# EAGLE design BetaRev1 (EAGLE 6.5.0)
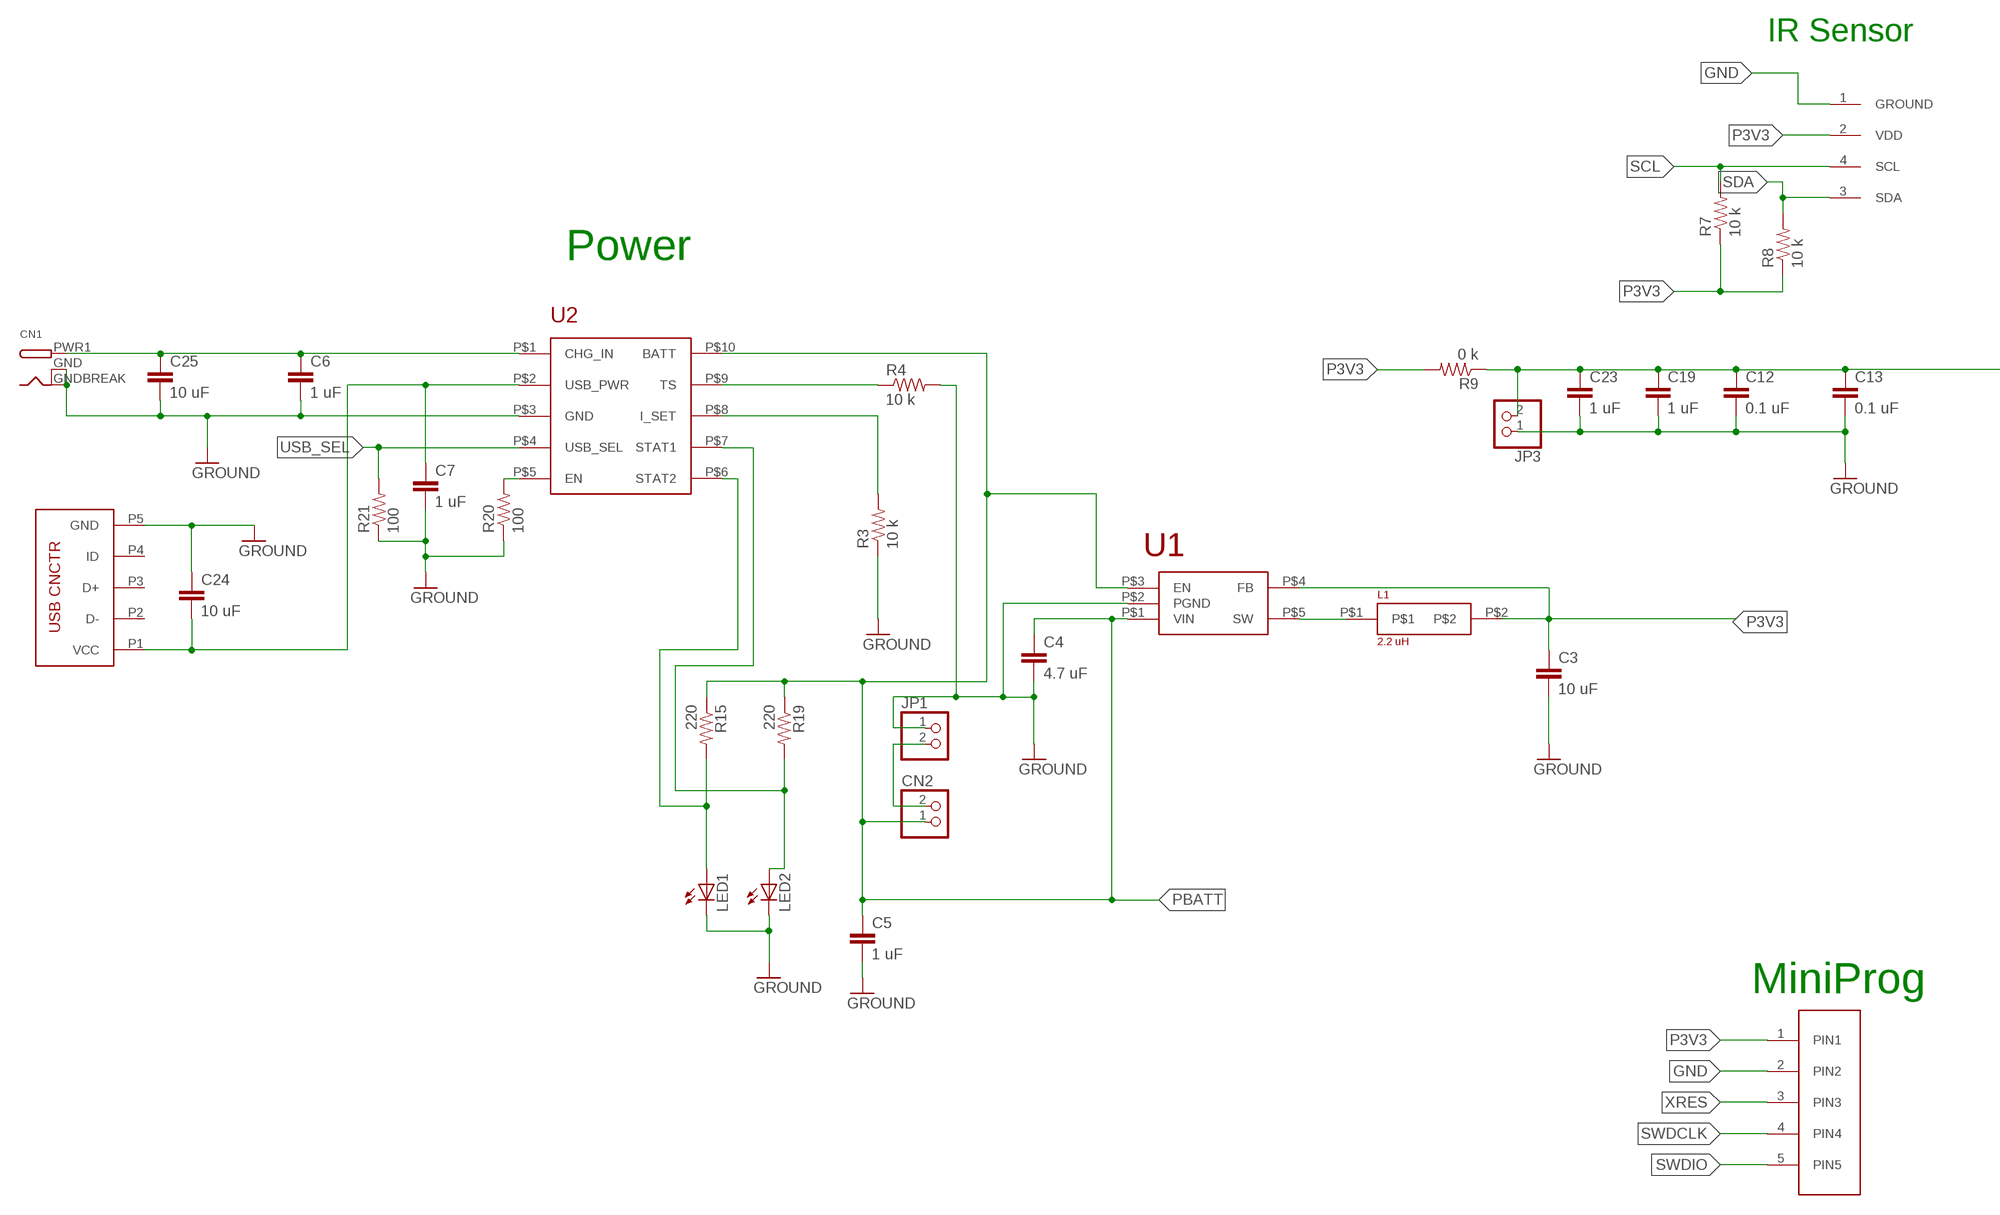
[diagram p0: schematic, sheet 1, part 1 of 2]
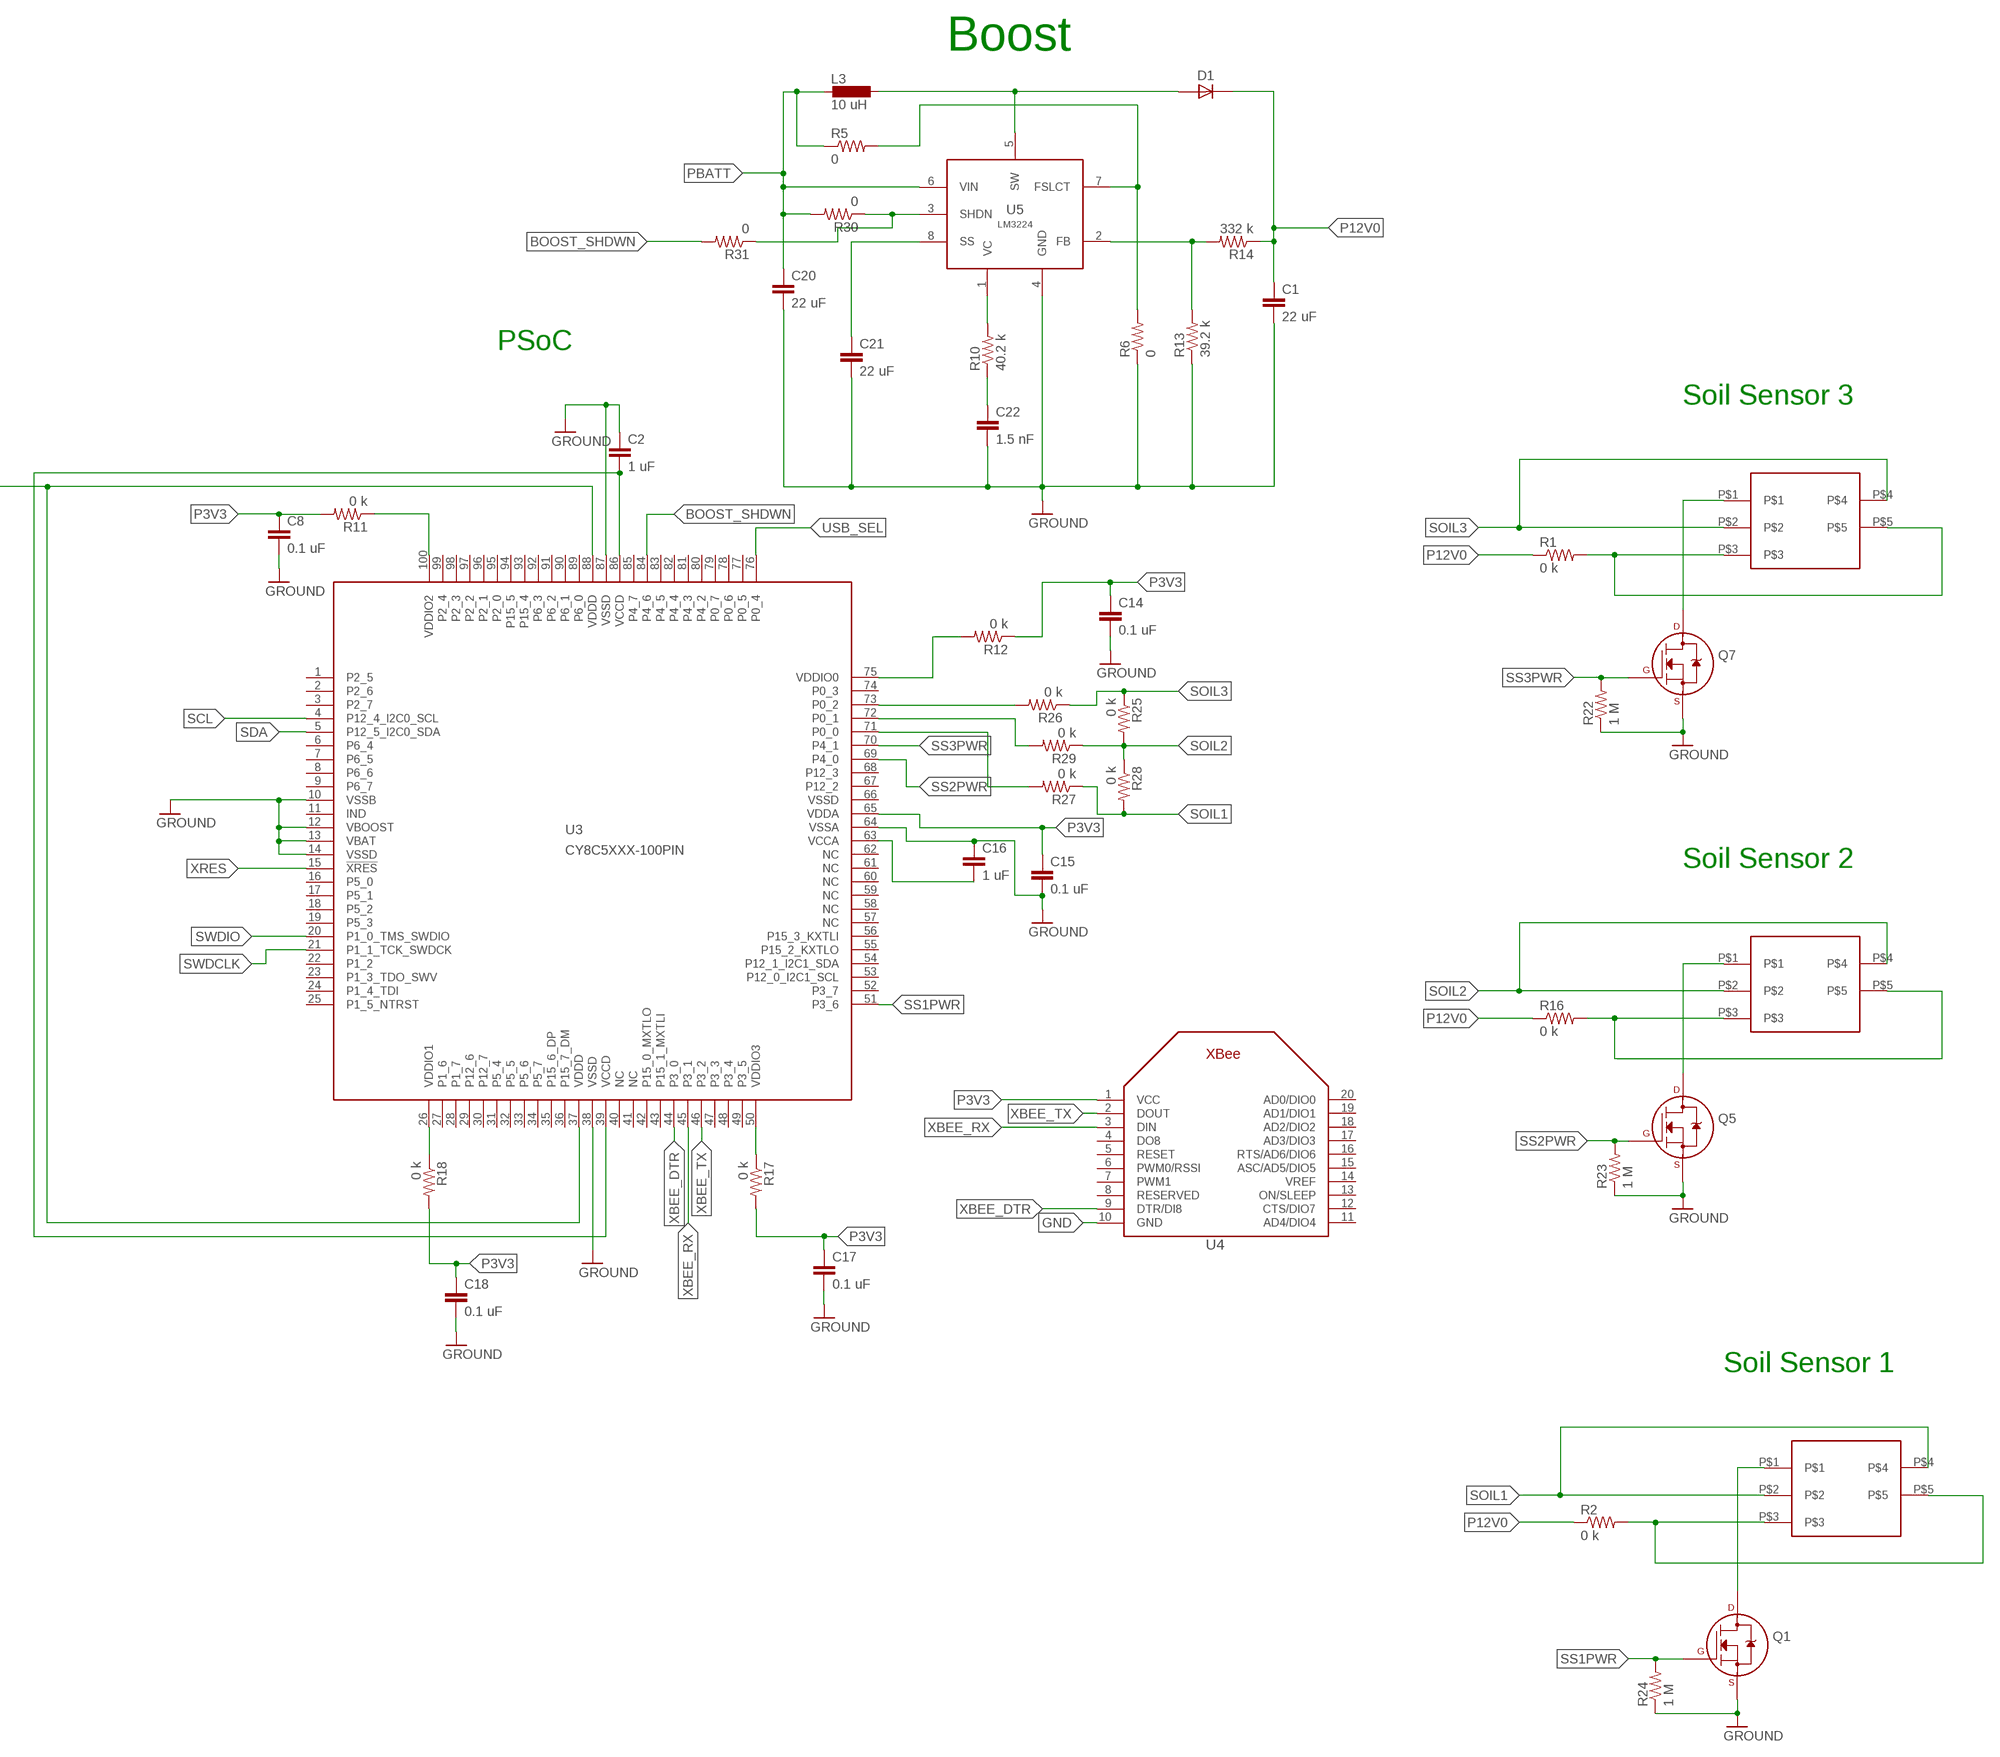
[diagram p1: schematic, sheet 1, part 2 of 2]

## Parts
C1  22 uF  CAPACITOR0805  [0805]
C2  1 uF  CAPACITOR0603  [0603]
C3  10 uF  CAPACITOR0603  [0603]
C4  4.7 uF  CAPACITOR0603  [0603]
C5  1 uF  CAPACITOR0603  [0603]
C6  1 uF  CAPACITOR0603  [0603]
C7  1 uF  CAPACITOR0603  [0603]
C8  0.1 uF  CAPACITOR0603  [0603]
C12  0.1 uF  CAPACITOR0603  [0603]
C13  0.1 uF  CAPACITOR0603  [0603]
C14  0.1 uF  CAPACITOR0603  [0603]
C15  0.1 uF  CAPACITOR0603  [0603]
C16  1 uF  CAPACITOR0603  [0603]
C17  0.1 uF  CAPACITOR0603  [0603]
C18  0.1 uF  CAPACITOR0603  [0603]
C19  1 uF  CAPACITOR0603  [0603]
C20  22 uF  CAPACITOR0603  [0603]
C21  22 uF  CAPACITOR0603  [0603]
C22  1.5 nF  CAPACITOR0603  [0603]
C23  1 uF  CAPACITOR0603  [0603]
C24  10 uF  CAPACITOR0603  [0603]
C25  10 uF  CAPACITOR0603  [0603]
CN1  DCBARRELSMT  [DCJACK_2MM_SMT]
CN2  JST_2PIN-SMT-RA  [JST-PH-2-SMT-RA]
D1  DIODE  [0603-LED]
IRSENSOR  TO39  [TO39]
JP1  PINHD-1X2  [1X02]
JP3  PINHD-1X2  [1X02]
L1  LPO3310  [LPO3310]
L3  10 uH  DO3316P  [DO3316P]
LED1  LEDCHIP-LED0603  [CHIP-LED0603]
LED2  LEDCHIP-LED0603  [CHIP-LED0603]
MINIPROG  HEADER-5  [NON-5]
Q1  2N7000_SOT23  [SOT-23]
Q5  2N7000_SOT23  [SOT-23]
Q7  2N7000_SOT23  [SOT-23]
R1  0 k  RESISTOR0603  [0603]
R2  0 k  RESISTOR0603  [0603]
R3  10 k  RESISTOR0603  [0603]
R4  10 k  RESISTOR0603  [0603]
R5  0  RESISTOR0603  [0603]
R6  0  RESISTOR0603  [0603]
R7  10 k  RESISTOR0603  [0603]
R8  10 k  RESISTOR0603  [0603]
R9  0 k  RESISTOR0603  [0603]
R10  40.2 k  RESISTOR0603  [0603]
R11  0 k  RESISTOR0603  [0603]
R12  0 k  RESISTOR0603  [0603]
R13  39.2 k  RESISTOR0603  [0603]
R14  332 k  RESISTOR0603  [0603]
R15  220  RESISTOR0603  [0603]
R16  0 k  RESISTOR0603  [0603]
R17  0 k  RESISTOR0603  [0603]
R18  0 k  RESISTOR0603  [0603]
R19  220  RESISTOR0603  [0603]
R20  100  RESISTOR0603  [0603]
R21  100  RESISTOR0603  [0603]
R22  1 M  RESISTOR0603  [0603]
R23  1 M  RESISTOR0603  [0603]
R24  1 M  RESISTOR0603  [0603]
R25  0 k  RESISTOR0603  [0603]
R26  0 k  RESISTOR0603  [0603]
R27  0 k  RESISTOR0603  [0603]
R28  0 k  RESISTOR0603  [0603]
R29  0 k  RESISTOR0603  [0603]
R30  0  RESISTOR0603  [0603]
R31  0  RESISTOR0603  [0603]
U1  LM3671-407564  [LM3671-407564]
U2  LM3658  [LM3658]
U3  CY8C5XXX-100PIN  [TQFP-14X14-100]
U4  XBEE  [XBEE]
U5  LM3224  [MSOP-8]
U$1  FCI10118192-0001LF  [FCI10118192-0001LF]
U$2  AUDIOJACK  [AUDIOJACK]
U$3  AUDIOJACK  [AUDIOJACK]
U$4  AUDIOJACK  [AUDIOJACK]

## Nets
BOOST_SHDWN: R31.2 U3.84(P4_6)
GND: C1.2 C2.1 C3.2 C4.2 C5.2 C6.2 C7.2 C8.2 C12.2 C13.2 C14.2 C15.2 C16.1 C17.2 C18.2 C19.2 C20.2 C21.2 C22.2 C23.2 C24.1 C25.2 CN1.GND(GNDBREAK) CN1.GNDBREAK(GND) IRSENSOR.1(GROUND) JP1.1 JP3.1 LED1.C LED2.C MINIPROG.2(PIN2) Q1.2(S) Q5.2(S) Q7.2(S) R3.1 R4.2 R6.1 R13.1 R20.1 R21.1 R22.1 R23.1 R24.1 U1.P$2(PGND) U2.P$3(GND) U3.10(VSSB) U3.12(VBOOST) U3.13(VBAT) U3.14(VSSD) U3.38(VSSD) U3.64(VSSA) U3.87(VSSD) U4.10(GND) U5.4(GND) U$1.P5(GND) ; supply symbol labelled GROUND
N$1: R20.2 U2.P$5(EN)
N$2: R3.2 U2.P$8(I_SET)
N$3: C21.1 U5.8(SS)
N$4: R1.2 U$3.P$3 U$3.P$5
N$5: C6.1 C25.1 CN1.PWR1(PWR) U2.P$1(CHG_IN)
N$6: R2.2 U$4.P$3 U$4.P$5
N$7: D1.A L3.2 U5.5(SW)
N$8: R4.1 U2.P$9(TS)
N$9: R10.2 U5.1(VC)
N$10: CN2.2 JP1.2
N$11: C22.1 R10.1
N$12: R13.2 R14.2 U5.2(FB)
N$13: C2.2 U3.39(VCCD) U3.86(VCCD)
N$14: Q1.3(D) U$4.P$1
N$15: C16.2 U3.63(VCCA)
N$16: R5.2 R6.2 U5.7(FSLCT)
N$17: R16.2 U$2.P$3 U$2.P$5
N$18: R12.2 U3.75(VDDIO0)
N$19: R11.1 U3.100(VDDIO2)
N$20: R18.1 U3.26(VDDIO1)
N$21: C12.1 C13.1 C19.1 C23.1 JP3.2 R9.1 U3.37(VDDD) U3.88(VDDD)
N$22: R17.1 U3.50(VDDIO3)
N$23: Q5.3(D) U$2.P$1
N$24: Q7.3(D) U$3.P$1
N$25: LED2.A R19.2 U2.P$7(STAT1)
N$26: LED1.A R15.2 U2.P$6(STAT2)
N$27: R26.2 U3.73(P0_2)
N$28: L1.P$1 U1.P$5(SW)
N$29: R29.2 U3.72(P0_1)
N$30: R27.2 U3.71(P0_0)
N$47: R30.1 R31.1 U5.3(SHDN)
P3V3: C3.1 C8.1 C14.1 C15.1 C17.1 C18.1 IRSENSOR.2(VDD) L1.P$2 MINIPROG.1(PIN1) R7.1 R8.1 R9.2 R11.2 R12.1 R17.2 R18.2 U1.P$4(FB) U3.65(VDDA) U4.1(VCC)
P12V0: C1.1 D1.C R1.1 R2.1 R14.1 R16.1
PBATT: C4.1 C5.1 C20.1 CN2.1 L3.1 R5.1 R15.1 R19.1 R30.2 U1.P$1(VIN) U1.P$3(EN) U2.P$10(BATT) U5.6(VIN)
SCL: IRSENSOR.4(SCL) R7.2 U3.4(P12_4_I2C0_SCL)
SDA: IRSENSOR.3(SDA) R8.2 U3.5(P12_5_I2C0_SDA)
SOIL1: R27.1 R28.2 U$4.P$2 U$4.P$4
SOIL2: R25.2 R28.1 R29.1 U$2.P$2 U$2.P$4
SOIL3: R25.1 R26.1 U$3.P$2 U$3.P$4
SS1PWR: Q1.1(G) R24.2 U3.51(P3_6)
SS2PWR: Q5.1(G) R23.2 U3.69(P4_0)
SS3PWR: Q7.1(G) R22.2 U3.70(P4_1)
SWDCLK: MINIPROG.4(PIN4) U3.21(P1_1_TCK_SWDCK)
SWDIO: MINIPROG.5(PIN5) U3.20(P1_0_TMS_SWDIO)
USB: C7.1 C24.2 U2.P$2(USB_PWR) U$1.P1(VCC)
USB_SEL: R21.2 U2.P$4(USB_SEL) U3.76(P0_4)
XBEE_DTR: U3.44(P3_0) U4.9(DTR/DI8)
XBEE_RX: U3.45(P3_1) U4.3(DIN)
XBEE_TX: U3.46(P3_2) U4.2(DOUT)
XRES: MINIPROG.3(PIN3) U3.15(!XRES!)
Unconnected: U3.1(P2_5) U3.2(P2_6) U3.3(P2_7) U3.6(P6_4) U3.7(P6_5) U3.8(P6_6) U3.9(P6_7) U3.11(IND) U3.16(P5_0) U3.17(P5_1) U3.18(P5_2) U3.19(P5_3) U3.22(P1_2) U3.23(P1_3_TDO_SWV) U3.24(P1_4_TDI) U3.25(P1_5_NTRST) U3.27(P1_6) U3.28(P1_7) U3.29(P12_6) U3.30(P12_7) U3.31(P5_4) U3.32(P5_5) U3.33(P5_6) U3.34(P5_7) U3.35(P15_6_DP) U3.36(P15_7_DM) U3.40(NC) U3.41(NC) U3.42(P15_0_MXTLO) U3.43(P15_1_MXTLI) U3.47(P3_3) U3.48(P3_4) U3.49(P3_5) U3.52(P3_7) U3.53(P12_0_I2C1_SCL) U3.54(P12_1_I2C1_SDA) U3.55(P15_2_KXTLO) U3.56(P15_3_KXTLI) U3.57(NC) U3.58(NC) U3.59(NC) U3.60(NC) U3.61(NC) U3.62(NC) U3.66(VSSD) U3.67(P12_2) U3.68(P12_3) U3.74(P0_3) U3.77(P0_5) U3.78(P0_6) U3.79(P0_7) U3.80(P4_2) U3.81(P4_3) U3.82(P4_4) U3.83(P4_5) U3.85(P4_7) U3.89(P6_0) U3.90(P6_1) U3.91(P6_2) U3.92(P6_3) U3.93(P15_4) U3.94(P15_5) U3.95(P2_0) U3.96(P2_1) U3.97(P2_2) U3.98(P2_3) U3.99(P2_4) U4.4(DO8) U4.5(RESET) U4.6(PWM0/RSSI) U4.7(PWM1) U4.8(RESERVED) U4.11(AD4/DIO4) U4.12(CTS/DIO7) U4.13(ON/SLEEP) U4.14(VREF) U4.15(ASC/AD5/DIO5) U4.16(RTS/AD6/DIO6) U4.17(AD3/DIO3) U4.18(AD2/DIO2) U4.19(AD1/DIO1) U4.20(AD0/DIO0) U$1.P2(D-) U$1.P3(D+) U$1.P4(ID)

## Notes on the sheet
- Boost
- IR Sensor
- PSoC
- Power
- Soil Sensor 3
- Soil Sensor 2
- MiniProg
- Soil Sensor 1

## Library data of the parts
C1-C8 C12-C25 = LAB1_BREAKOUT:CAPACITOR: Generic Capacitor
CN1 = adafruit:DCBARREL: 2.0mm DC Barrel Jack DCJACK_2MM_PTH - Through Hole Jack (4UConnector: 05537)
CN2 = adafruit:JST_2PIN: JST 2-Pin Connectors of various flavors SMT-RA (S2B-PH-SM4) 4UConnector #17311 SMT (B2B-PH-SM4) THM-RA (S2B-PH) THM (B2B-PH)
D1 = Alpha (3):DIODE
IRSENSOR = mlx:TO39
JP1 JP3 = pinhead:PINHD-1X2: PIN HEADER
L1 = 136PWR:LPO3310: Coilcraft LPO3310 2.2 uH power inductor 150 mOhms
L3 = inductor-coilcraft:DO3316P: COILCRAFT; OC_FARNELL: unknown; OC_NEWARK: unknown
LED1 LED2 = adafruit:LED: LED OSRAM: - CHIPLED LG R971, LG N971, LY N971, LG Q971, LY Q971, LO R971, LY R971 LH N974, LH R974 LS Q976, LO Q976, LY Q976 LO Q996 - Hyper CHIPLED LW Q18S LB Q993, LB Q99A, LB R99A - SideLED LS A670, LO A670, LY A670, LG A670, LP A670 LB A673, LV A673, LT A673, LW A673 LH A674 LY A675 LS A676, LA A676, LO A676, LY A676, LW A676 LS A679, LY A679, LG A679 - Hyper Micro SIDELED® LS Y876, LA Y876, LO Y876, LY Y876 LT Y87S - SmartLED LW L88C, LW L88S LB L89C, LB L89S, LG L890 LS L89K, LO L89K, LY L89K LS L896, LA L896, LO L896, LY L896 - TOPLED LS T670, LO T670, LY T670, LG T670, LP T670 LSG T670, LSP T670, LSY T670, LOP T670, LYG T670 LG T671, LOG T671, LSG T671 LB T673, LV T673, LT T673, LW T673 LH T674 LS T676, LA T676, LO T676, LY T676, LB T676, LH T676, LSB T676, LW T676 LB T67C, LV T67C, LT T67C, LS T67K, LO T67K, LY T67K, LW E67C LS E67B, LA E67B, LO E67B, LY E67B, LB E67C, LV E67C, LT E67C LW T67C LS T679, LY T679, LG T679 LS T770, LO T770, LY T770, LG T770, LP T770 LB T773, LV T773, LT T773, LW T773 LH T774 LS E675, LA E675, LY E675, LS T675 LS T776, LA T776, LO T776, LY T776, LB T776 LHGB T686 LT T68C, LB T68C - Hyper Mini TOPLED® LB M676 - Mini TOPLED Santana® LG M470 LS M47K, LO M47K, LY M47K Source: http://www.osram.convergy.de/
MINIPROG = LAB1_BREAKOUT:HEADER-5: General 5 Pin 1 Row 2.54mm Spacing Connector
Q1 Q5 Q7 = transistors:2N700*: 2N7000, 2N7002, NDS7002A N-channel enhancement mode MOSFET
R1-R31 = LAB1_BREAKOUT:RESISTOR: Generic Resistor
U1 = 136PWR:LM3671-407564: DC DC voltage regulator
U2 = LM3658:LM3658
U3 = cypress_psoc_V2_0:CY8C5XXX-100PIN: Cypress PSoC® 5 - Programmable System on Chip, ARM Cortex-M3 Based Source Data: http://www.cypress.com/?mpn=CY8C5588AXI-060 LBR Source: http://www.westmarkelectronics.com Thomas W. Moxon Director of Engineering www.westmarkelectronics.com; MPN: CY8C5588AXI-060
U4 = Alpha (3):XBEE
U5 = Alpha (3):LM3224
U$1 = USB_Connectors_5P_Micro_USB:FCI10118192-0001LF
U$2-U$4 = AudioJack:AUDIOJACK

## Board
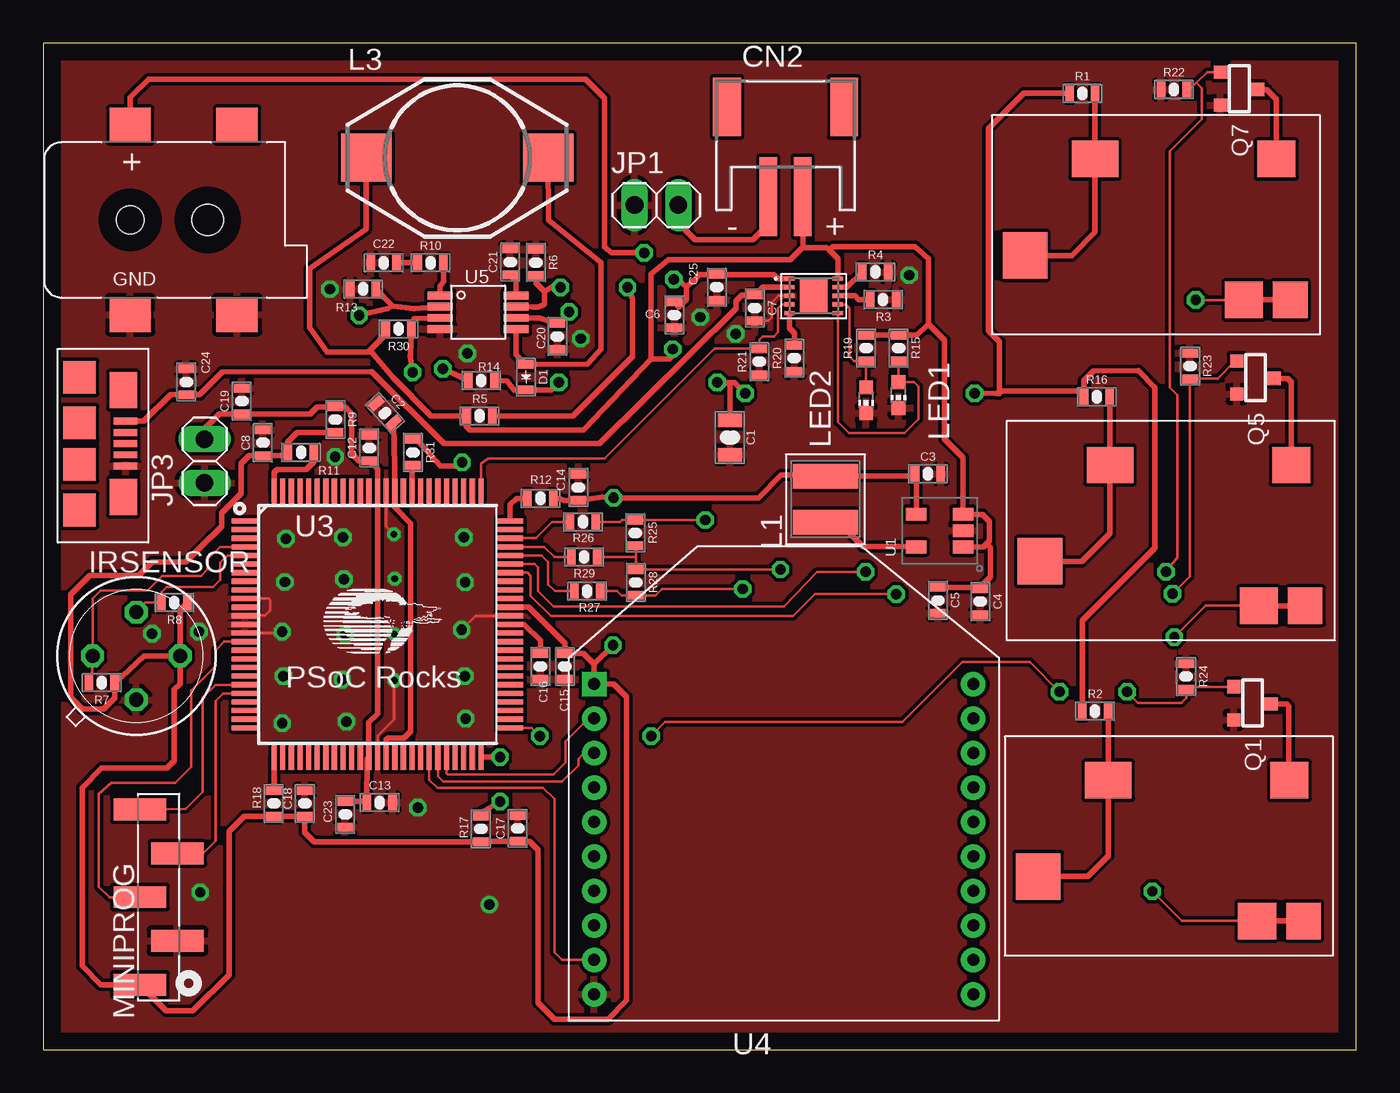
[diagram p2: board, top side]
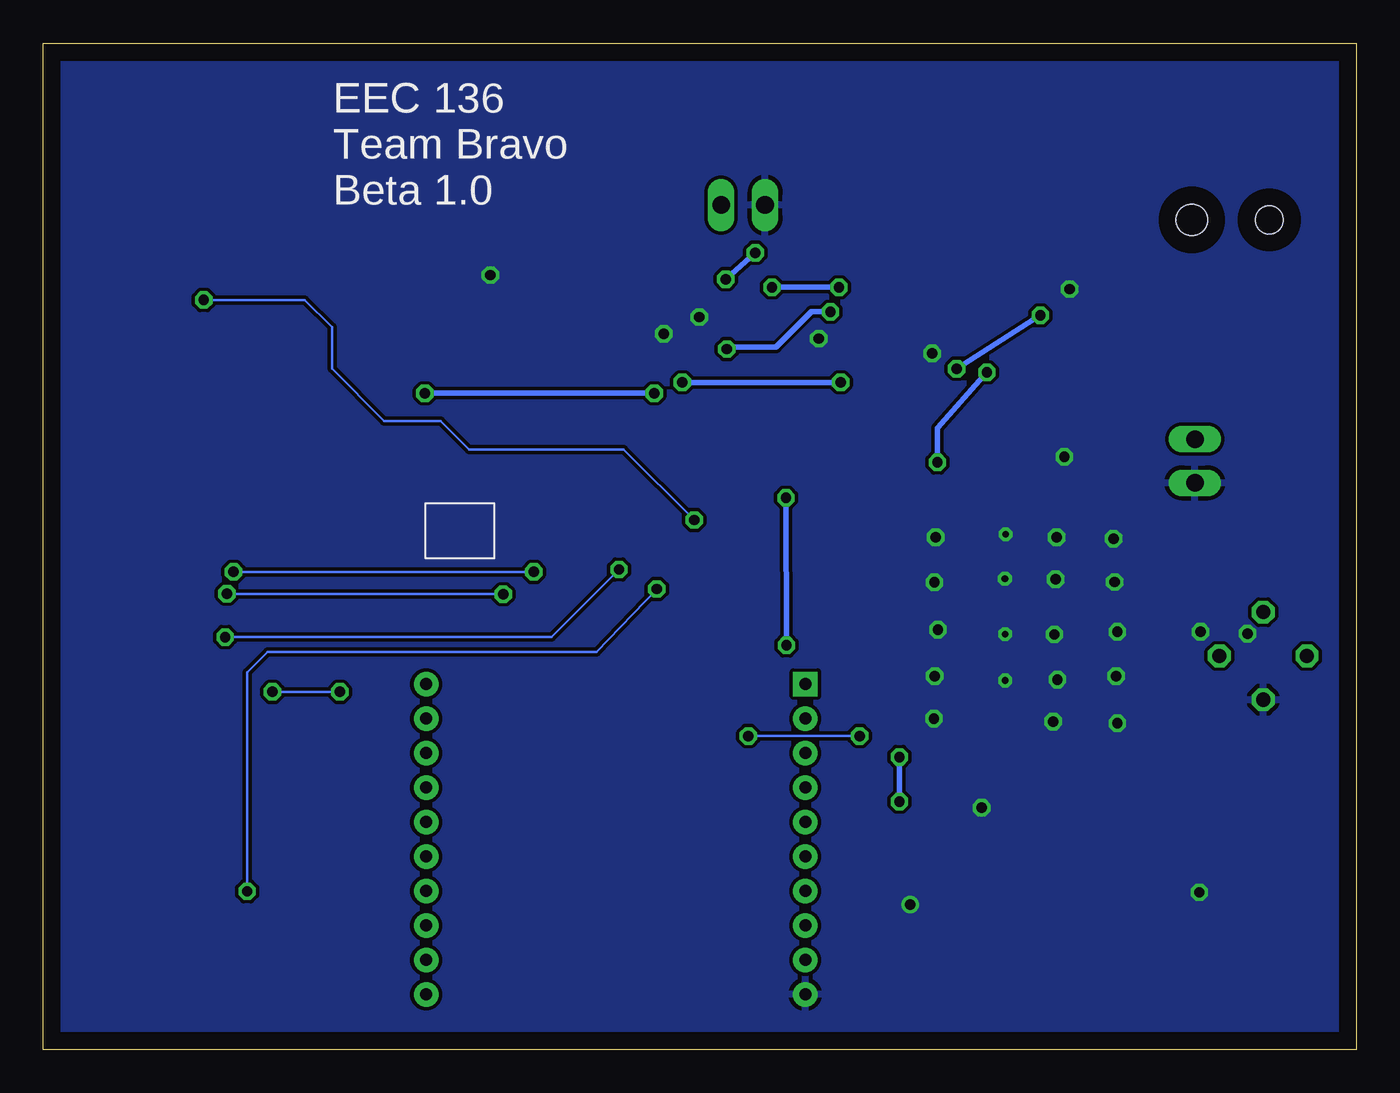
[diagram p3: board, bottom side, seen from below]

Size 76.2 x 58.42 mm. Coordinates in mm from the lower left corner, seen from the top.
Outline: 0,0 76.2,0 76.2,58.42 0,58.42 0,0
Copper layers (1*16): Top 0.035mm / dielectric 1.5mm / Bottom 0.035mm
Design rules "default": minimum track width 10mil, minimum drill 24mil, track to track 8mil, track to pad 8mil, pad to pad 8mil, via to via 8mil, smd to smd 8mil, copper to edge 40mil, drill to drill 8mil, minimum pad ring 10mil, minimum via ring 8mil, stop-mask expansion 4mil, vias tented up to drill 0mil, thermal gap 10mil

### Footprints (pad centres in the part's own frame; a part is rotated, then mirrored left to right if it is on the bottom)
0805 = smd 0.8 x 1.4: 1 -1,0; 2 1,0
0603 = smd 0.5 x 0.9: 1 -0.75,0; 2 0.75,0
DCJACK_2MM_SMT = smd 2.4 x 2: GND 0,-5.5; GNDBREAK 6.2,-5.5; PWR1 0,5.5; PWR2 6.2,5.5 | hole 1.6: 0,0 | hole 1.8: 4.5,0
JST-PH-2-SMT-RA = smd 1 x 4.6: 1 1,-3.7; 2 -1,-3.7 | smd 1.6 x 3.4: NC1 -3.4,1.5; NC2 3.4,1.5
0603-LED = smd 0.5 x 0.9: A -0.75,0; C 0.75,0
TO39 = drill 0.813 octagon: 1 0,-2.54; 2 2.54,0; 3 0,2.54; 4 -2.54,0
1X02 = drill 1.016 long: 1 -1.27,0; 2 1.27,0
LPO3310 = smd 1.42 x 3.76: P$1 -1.34,0; P$2 1.34,0
DO3316P = smd 2.92 x 2.79: 1 -5.28,0; 2 5.28,0
CHIP-LED0603 = smd 0.8 x 0.8: A 0,-0.75; C 0,0.75
NON-5 = smd 1.27 x 3.061: 1 -5.08,1.086; 2 -2.54,-1.086; 3 0,1.086; 4 2.54,-1.086; 5 5.08,1.086
SOT-23 = smd 0.762 x 0.762: 1 -0.979,-1.101; 2 0.94,-1.101; 3 0.025,1.067
LM3671-407564 = smd 0.74 x 1.19: P$1 -0.95,-1.35; P$2 0,-1.35; P$3 0.95,-1.35; P$4 0.95,1.35; P$5 -0.95,1.35
LM3658 = smd 0.6 x 0.25: P$1 0,0; P$2 0,-0.5; P$3 0,-1; P$4 0,-1.5; P$5 0,-2; P$6 2.8,-2; P$7 2.8,-1.5; P$8 2.8,-1; P$9 2.8,-0.5; P$10 2.8,0 | smd 1.6 x 2: P$11 1.4,-1
TQFP-14X14-100 = smd 1.5 x 0.3: 1 -7.7,6; 2 -7.7,5.5; 3 -7.7,5; 4 -7.7,4.5; 5 -7.7,4; 6 -7.7,3.5; 7 -7.7,3; 8 -7.7,2.5; 9 -7.7,2; 10 -7.7,1.5; 11 -7.7,1; 12 -7.7,0.5; 13 -7.7,0; 14 -7.7,-0.5; 15 -7.7,-1; 16 -7.7,-1.5; 17 -7.7,-2; 18 -7.7,-2.5; 19 -7.7,-3; 20 -7.7,-3.5; 21 -7.7,-4; 22 -7.7,-4.5; 23 -7.7,-5; 24 -7.7,-5.5; 25 -7.7,-6; 51 7.7,-6; 52 7.7,-5.5; 53 7.7,-5; 54 7.7,-4.5; 55 7.7,-4; 56 7.7,-3.5; 57 7.7,-3; 58 7.7,-2.5; 59 7.7,-2; 60 7.7,-1.5; 61 7.7,-1; 62 7.7,-0.5; 63 7.7,0; 64 7.7,0.5; 65 7.7,1; 66 7.7,1.5; 67 7.7,2; 68 7.7,2.5; 69 7.7,3; 70 7.7,3.5; 71 7.7,4; 72 7.7,4.5; 73 7.7,5; 74 7.7,5.5; 75 7.7,6 | smd 0.3 x 1.5: 26 -6,-7.7; 27 -5.5,-7.7; 28 -5,-7.7; 29 -4.5,-7.7; 30 -4,-7.7; 31 -3.5,-7.7; 32 -3,-7.7; 33 -2.5,-7.7; 34 -2,-7.7; 35 -1.5,-7.7; 36 -1,-7.7; 37 -0.5,-7.7; 38 0,-7.7; 39 0.5,-7.7; 40 1,-7.7; 41 1.5,-7.7; 42 2,-7.7; 43 2.5,-7.7; 44 3,-7.7; 45 3.5,-7.7; 46 4,-7.7; 47 4.5,-7.7; 48 5,-7.7; 49 5.5,-7.7; 50 6,-7.7; 76 6,7.7; 77 5.5,7.7; 78 5,7.7; 79 4.5,7.7; 80 4,7.7; 81 3.5,7.7; 82 3,7.7; 83 2.5,7.7; 84 2,7.7; 85 1.5,7.7; 86 1,7.7; 87 0.5,7.7; 88 0,7.7; 89 -0.5,7.7; 90 -1,7.7; 91 -1.5,7.7; 92 -2,7.7; 93 -2.5,7.7; 94 -3,7.7; 95 -3.5,7.7; 96 -4,7.7; 97 -4.5,7.7; 98 -5,7.7; 99 -5.5,7.7; 100 -6,7.7
XBEE = drill 0.7 pad 1.422 square: 1 -11,5.5 | drill 0.7 pad 1.422: 2 -11,3.5; 3 -11,1.5; 4 -11,-0.5; 5 -11,-2.5; 6 -11,-4.5; 7 -11,-6.5; 8 -11,-8.5; 9 -11,-10.5; 10 -11,-12.5; 11 11,-12.5; 12 11,-10.5; 13 11,-8.5; 14 11,-6.5; 15 11,-4.5; 16 11,-2.5; 17 11,-0.5; 18 11,1.5; 19 11,3.5; 20 11,5.5
MSOP-8 = smd 1.45 x 0.45: 1 -2.2,0.975; 2 -2.2,0.325; 3 -2.2,-0.325; 4 -2.2,-0.975; 5 2.2,-0.975; 6 2.2,-0.325; 7 2.2,0.325; 8 2.2,0.975
FCI10118192-0001LF = smd 0.4 x 1.35: P1 -1.3,2.675; P2 -0.65,2.675; P3 0,2.675; P4 0.65,2.675; P5 1.3,2.675 | smd 1.9 x 1.9: P$1 -1.2,0; P$2 1.2,0; P$3 3.85,0; P$4 -3.85,0 | smd 2.1 x 1.6: P$5 -3.1,2.55; P$6 3.1,2.55
AUDIOJACK = smd 2.21 x 2.108: P$1 1.27,-2.54; P$2 3.15,5.626 | smd 2.692 x 2.108: P$3 11.786,-2.54 | smd 2.007 x 2.108: P$4 0.457,5.626 | smd 2.591 x 2.692: P$5 15.85,3.048

### Placement (x,y rotation side)
C1  39.85,35.53 270 top
C2  19.84,36.96 311.8 top
C3  51.33,33.43 0 top
C4  54.38,26.01 270 top
C5  51.92,26.09 270 top
C6  36.63,42.65 270 top
C7  41.3,43.05 270 top
C8  12.75,35.23 90 top
C12  18.92,34.92 90 top
C13  19.53,14.35 0 top
C14  31.06,32.64 90 top
C15  30.28,22.25 270 top
C16  28.85,22.25 90 top
C17  27.53,12.85 90 top
C18  15.19,14.3 90 top
C19  11.53,37.64 90 top
C20  29.84,41.4 270 top
C21  27.1,45.72 90 top
C22  19.76,45.67 180 top
C23  17.53,13.67 270 top
C24  8.31,38.76 270 top
C25  39.09,44.25 270 top
CN1  5.05,48.16 0 top
CN2  43.08,53.21 0 top
D1  28.02,39.04 270 top
IRSENSOR  5.41,22.86 0 top
JP1  35.59,49.02 0 top
JP3  9.37,34.16 90 top
L1  45.39,31.95 90 top
L3  24.03,51.77 0 top
LED1  49.63,38 180 top
LED2  47.75,37.69 180 top
MINIPROG  6.71,8.86 90 top
Q1  70.18,20.09 270 top
Q5  70.36,38.99 270 top
Q7  69.42,55.75 270 top
R1  60.3,55.5 0 top
R2  61.04,19.66 0 top
R3  48.74,43.54 180 top
R4  48.29,45.14 0 top
R5  25.32,36.78 0 top
R6  28.6,45.69 270 top
R7  3.4,21.31 180 top
R8  7.62,25.96 180 top
R9  16.97,36.58 270 top
R10  22.48,45.67 0 top
R11  14.96,34.67 180 top
R12  28.85,32 180 top
R13  18.57,44.15 0 top
R14  25.43,38.84 180 top
R15  49.63,40.72 270 top
R16  61.14,37.9 0 top
R17  25.4,12.83 270 top
R18  13.39,14.3 270 top
R19  47.75,40.72 270 top
R20  43.59,40.13 90 top
R21  41.55,39.93 90 top
R22  65.61,55.73 0 top
R23  66.55,39.67 270 top
R24  66.32,21.67 270 top
R25  34.37,30 270 top
R26  31.32,30.63 180 top
R27  31.57,26.62 180 top
R28  34.39,27.13 270 top
R29  31.39,28.6 180 top
R30  20.62,41.83 180 top
R31  21.46,34.67 270 top
U1  52.02,30.12 90 top
U2  43.31,44.75 0 top
U3  19.41,24.69 0 top
U4  42.98,15.72 0 top
U5  25.25,42.8 0 top
U$1  2.11,35.18 270 top
U$2  73.69,31.39 180 top
U$3  72.82,49.15 180 top
U$4  73.58,13.11 180 top

### Tracks (layer width: path | path; a pad name or v marks a point on that pad's centre or on a via)
BOOST_SHDWN
  Top 0.305: U3.84 21.41,33.86 R31.2
GND  (via drill 0.38 pad 0.33, 0.6, 0.6 pad 0.33)
  Top 0.152: U3.87 19.91,30.36 v20.34,29.92 | U3.14 13.8,24.19 v13.87,24.26 | U3.10 13.08,26.19 13.18,26.09 13.18,25.5 12.88,25.2 U3.12 | U3.64 25.09,25.19 v24.28,24.38 | U3.38 19.41,18.21 20.37,19.18 v20.37,21.44 | U2.P$3 42.66,43.76 42.29,43.38 42.29,42.52 42.09,42.32 41.31,42.32 C7.2
  other vias: 25.88,8.43 13.87,18.95 17.6,19.05 24.51,19.23 24.46,21.69 17.35,21.49 13.94,21.69 17.53,24.1 20.37,24.13 24.49,27.13 20.4,27.33 17.45,27.3 14.02,27.15 21.74,14.05 14.1,29.67 17.4,29.74 24.41,29.74 16.94,34.42 9.12,9.14 6.32,24.16 9.04,24.26 31.19,41.27 50.24,44.96 40.18,41.55 38.13,42.52 16.64,44.15 24.61,40.41
  pour Bottom: -6.35,82.55 -15.24,82.55 -15.24,-3.81 115.57,-3.81 115.57,82.55
  pour Top: -11.43,86.36 -11.43,-7.62 109.22,-7.62 109.22,85.09 -10.16,85.09 -10.16,86.36
N$1
  Top 0.305: U2.P$5 43.31,41.88 43.59,41.6 R20.2
N$2
  Top 0.305: U2.P$8 47.1,43.76 47.32,43.54 R3.2
N$3
  Top 0.305: U5.8 27.45,44.62 C21.1
N$4
  Top 0.305: U$3.P$5 59.69,46.1 61.04,47.45 U$3.P$3 61.04,55.49 R1.2
N$5  (via drill 0.6 pad 0.33)
  Top 0.305: U2.P$1 42.6,44.76 42.37,44.98 39.1,44.98 C25.1 38.09,45 37.34,44.25 | 37.34,44.25 37.08,44.5 v36.59,44.72 | v34.87,46.25 32.99,46.25 32.59,46.58 32.59,55.22 31.47,56.34 6.12,56.34 5.05,55.27 CN1.PWR1 | C6.1 36.87,43.09 37.34,43.56 37.34,44.25
  Bottom 0.305: v36.59,44.72 v34.87,46.25
N$6
  Top 0.305: U$4.P$5 60.6,10.06 61.8,11.25 U$4.P$3 61.8,19.65 R2.2
N$7
  Top 0.305: L3.2 29.33,48.14 32.36,45.7 32.36,40.66 31.6,39.8 28.03,39.78 D1.A 27.45,40.36 U5.5
N$8
  Top 0.305: U2.P$9 46.65,44.26 R4.1
N$9
  Top 0.305: U5.1 23.05,44.31 23.24,44.58 R10.2
N$10
  Top 0.305: JP1.2 36.85,47.98 37.82,47.02 41.2,47.02 42.06,47.88 42.06,49.5 CN2.2
N$11
  Top 0.305: R10.1 C22.1
N$12  (via drill 0.6 pad 0.33)
  Top 0.305: U5.2 21.52,43.02 20.28,43.17 | 20.28,43.17 R13.2 | R14.2 v23.19,39.52 | v18.34,42.62 19.99,43.01 20.28,43.17
  Bottom 0.305: v23.19,39.52 v18.34,42.62
N$13
  Top 0.305: U3.39 19.91,18.01 20.02,18.11 20.95,18.11 21.34,18.49 21.34,30.56 20.41,31.49 U3.86 20.41,33.78 C2.2
N$14
  Top 0.305: Q1.3 72.16,20.07 72.29,19.94 72.29,15.67 U$4.P$1
N$15
  Top 0.305: U3.63 27.91,24.69 28.85,23.75 C16.2
N$16  (via drill 0.6 pad 0.33)
  Top 0.305: R5.2 30.73,36.78 34.21,40.23 34.21,43.59 v33.91,44.25 | v30.02,44.25 29.49,44.25 29.09,44 | U5.7 28.39,43.1 28.73,43.1 29.06,43.26 29.08,43.31 29.09,44 | R6.2 28.6,44.48 29.09,44
  Bottom 0.305: v33.91,44.25 v30.02,44.25
N$17
  Top 0.305: U$2.P$5 60.27,28.35 61.9,29.97 U$2.P$3 61.9,37.88 R16.2
N$18
  Top 0.305: U3.75 27.11,31.65 27.46,32 R12.2
N$19
  Top 0.305: U3.100 13.41,33.5 13.59,33.68 15.27,33.68 15.7,34.11 15.7,34.66 R11.1
N$20
  Top 0.305: U3.26 13.41,15.07 R18.1
N$21
  Top 0.305: C23.1 18.72,14.41 C13.1 18.81,16.89 U3.37 18.9,17 18.9,19 19.41,19.51 U3.88 19.41,33.69 C12.1 18.34,34.16 17.91,34.59 17.91,36.93 17.51,37.33 R9.1 16.95,37.31 15.9,37.31 15.48,36.89 C19.1 10.21,36.88 9.37,36.04 JP3.2
N$22  (via drill 0.6 pad 0.33)
  Top 0.305: R17.1 25.4,13.79 v26.52,14.4 | v26.52,16.99 U3.50
  Bottom 0.305: v26.52,14.4 v26.52,16.99
N$23
  Top 0.305: Q5.3 72.21,38.96 72.42,38.76 U$2.P$1
N$24
  Top 0.305: Q7.3 70.99,55.73 71.55,55.17 U$3.P$1
N$25
  Top 0.152: U2.P$7 46.56,43.26 46.79,43.03 46.79,40.23 47.04,39.98 47.74,39.98 R19.2 LED2.A
N$26
  Top 0.152: U2.P$6 46.11,36.44 46.76,35.79 49.99,35.79 50.8,36.6 50.8,38.48 50.52,38.76 49.64,38.76 LED1.A R15.2
N$27
  Top 0.152: U3.73 28.6,29.69 29.54,30.63 R26.2
N$28
  Top 0.305: L1.P$1 46.17,30.61 47.57,29.21 50.63,29.21 U1.P$5
N$29
  Top 0.152: U3.72 29.08,29.19 29.67,28.6 R29.2
N$30
  Top 0.152: U3.71 28.92,28.69 29.31,28.3 29.31,27 29.69,26.62 R27.2
N$47  (via drill 0.6 pad 0.33)
  Top 0.305: U5.3 21.53,42.42 R30.1 21.32,40.32 21.29,40.28 v21.44,39.32 | R31.1 21.68,35.42 23.06,33.88 23.95,33.88 v24.31,34.09
  Bottom 0.305: v24.31,34.09 24.31,36.07 v21.44,39.32
P3V3  (via drill 0.6 pad 0.33)
  Top 0.305: R9.2 14.74,35.83 14.2,35.28 14.2,34.68 R11.2 14.02,34.48 C8.1 11.95,34.48 11.51,34.04 11.51,32.28 10.36,31.14 10.36,30.38 9.8,29.82 9.78,29.82 8.28,28.32 6.33,28.32 5.54,27.53 2.72,27.53 1.6,26.42 1.6,20.45 2.26,19.79 3.53,19.79 4.15,20.41 R7.1 4.58,21.67 5.86,22.86 IRSENSOR.2 | R12.1 29.6,32.02 29.95,32 30.27,31.88 C14.1 32.45,32.09 v33.1,32.03 41.5,32.03 42.82,33.35 45.33,33.35 L1.P$2 50.45,33.29 C3.1 50.67,33.34 U1.P$4 | 31.98,22.38 U4.1 31.99,21.23 33.1,21.23 33.86,20.47 33.86,2.87 32.77,1.78 29.67,1.78 28.73,2.72 28.73,11.61 28.23,12.1 C17.1 25.43,12.1 R17.2 15.74,12.08 15.19,12.62 C18.1 R18.2 11.67,13.55 10.79,12.68 10.79,4.37 8.69,2.26 7.14,2.26 MINIPROG.1 3.35,3.79 2.26,4.88 2.26,15.21 3.4,16.36 7.21,16.36 7.62,16.76 7.62,20.9 7.95,21.23 IRSENSOR.2 | 31.98,22.38 31.34,23.01 30.29,23.01 C15.1 30.28,23.57 28.16,25.69 U3.65 | v33.07,23.47 31.98,22.38 | IRSENSOR.2 7.95,25.54 R8.1
  Bottom 0.305: v33.1,32.03 v33.07,23.47
P12V0  (via drill 0.6 pad 0.33)
  Top 0.305: R14.1 26.92,38.81 27.33,38.28 28,38.28 D1.C 29.48,38.29 v29.92,38.73 | v39.12,38.73 39.8,38.73 | C1.1 39.85,38.61 39.8,38.73 | 39.8,38.73 40.11,38.73 v40.74,38.1 | v54.05,38.1 55.31,38.08 | 55.31,38.08 55.47,38.08 | R1.1 56.9,55.5 54.84,53.44 54.84,41.73 55.47,41.1 55.47,38.24 | 55.47,38.24 55.31,38.08 | 55.47,38.24 60.05,38.24 R16.1 60.38,37.91 60.38,38.84 60.94,39.4 63.55,39.42 64.52,38.43 64.52,29.13 60.29,24.93 R2.1
  Bottom 0.305: v29.92,38.73 v39.12,38.73 | v40.74,38.1 v54.05,38.1
PBATT  (via drill 0.6 pad 0.33)
  Top 0.305: L3.1 18.75,47.63 15.47,45.34 15.47,41.91 16.48,40.49 18.87,40.49 | 18.87,40.49 19.07,40.49 20.3,39.01 22.5,36.78 R5.1 24.56,36.49 24.54,36.2 24.77,35.97 31.34,35.97 35.28,40.08 | U5.6 28.8,42.47 C20.1 v30.52,42.82 | CN2.1 44.08,46.57 | 44.08,46.57 43.36,45.85 36.3,45.85 35.28,45.01 35.28,40.08 | U2.P$10 46.11,45.92 45.62,46.41 | 45.62,46.41 45.47,46.56 44.09,46.56 44.08,46.57 | 51.36,42.11 50.71,41.47 R15.1 R19.1 | 51.36,42.11 51.36,45.92 50.6,46.61 45.82,46.61 45.62,46.41 | 51.36,42.11 52.3,41.17 52.3,35.43 53.37,34.37 U1.P$3 54.5,31.07 54.91,30.66 54.91,29.54 54.75,29.38 | 54.75,29.38 54.56,29.18 53.38,29.18 U1.P$1 | C5.1 54.3,26.84 C4.1 54.38,26.85 54.97,27.43 54.97,29.16 54.75,29.38 | R30.2 19.82,41.44 18.87,40.49 | 35.28,40.08 36.32,40.08 36.52,40.28 v36.52,40.66
  Bottom 0.305: v36.52,40.66 36.42,40.77 33.68,40.77 31.62,42.82 v30.52,42.82
SCL
  Top 0.152: U3.4 10.27,29.19 9.55,28.47 9.55,27.89 9.17,27.51 6.91,27.51 6.07,26.67 3.35,26.67 2.87,26.19 IRSENSOR.4 2.86,21.93 R7.2
SDA
  Top 0.152: IRSENSOR.3 5.41,25.45 5.92,25.96 R8.2 6.88,25.97 6.88,26.57 7.16,26.85 9.88,26.85 10.29,27.25 10.29,28.27 10.71,28.69 U3.5
SOIL1  (via drill 0.6 pad 0.33)
  Top 0.152: R27.1 33.3,26.62 33.55,26.36 34.38,26.36 R28.2 35.55,26.38 35.92,26.75 v40.59,26.75 | v64.36,9.2 66.08,7.48 U$4.P$2
  Top 0.305: U$4.P$4 U$4.P$2
  Bottom 0.152: v40.59,26.75 44.09,23.09 63.17,23.09 64.36,21.89 v64.36,9.2
SOIL2  (via drill 0.6 pad 0.33)
  Top 0.152: 34.39,28.55 R28.1 v42.79,27.88 | 34.39,28.55 34.39,29.22 R25.2 | R29.1 34.34,28.6 34.39,28.55 | v65.63,23.95 67.46,25.78 70.52,25.78 U$2.P$2
  Top 0.305: U$2.P$4 U$2.P$2
  Bottom 0.152: v42.79,27.88 46.71,23.95 v65.63,23.95
SOIL3  (via drill 0.6 pad 0.33)
  Top 0.152: R26.1 33.48,30.63 33.6,30.76 34.35,30.76 R25.1 v38.42,30.75 | v66.88,43.51 U$3.P$2
  Top 0.305: U$3.P$4 U$3.P$2
  Bottom 0.152: v38.42,30.75 42.52,34.85 51.49,34.85 53.14,36.5 56.41,36.5 59.44,39.52 59.44,41.94 61.01,43.51 v66.88,43.51
SS1PWR  (via drill 0.6 pad 0.33)
  Top 0.152: U3.51 28.35,18.69 v28.83,18.21 | v35.28,18.21 36.09,19.02 49.86,19.02 53.34,22.5 57.25,22.5 v58.98,20.78 | v62.89,20.78 63.52,20.14 66.04,20.14 66.32,20.42 R24.2 66.47,21.07 Q1.1
  Bottom 0.152: v28.83,18.21 v35.28,18.21 | v58.98,20.78 v62.89,20.78
SS2PWR  (via drill 0.6 pad 0.33)
  Top 0.152: U3.69 28.11,27.69 28.3,27.51 28.3,26.34 29.46,25.17 43.51,25.17 44.78,26.44 v49.51,26.44 | v65.53,26.47 66.55,27.48 R23.2 66.59,38.96 68.15,38.96 69.15,39.97 Q5.1
  Bottom 0.152: v49.51,26.44 65.1,26.47 v65.53,26.47
SS3PWR  (via drill 0.6 pad 0.33)
  Top 0.152: U3.70 28.53,28.19 28.73,27.99 28.73,26.62 29.62,25.73 42.98,25.73 44.91,27.74 v47.73,27.74 | v65.15,27.74 65.81,28.57 65.81,38 65.38,38.43 65.38,52.15 67.23,54 67.23,55.8 66.92,56.12 | R22.2 66.52,55.73 66.92,56.12 | 66.92,56.12 67.54,56.74 68.31,56.74 Q7.1
  Bottom 0.152: v47.73,27.74 v65.15,27.74
SWDCLK
  Top 0.152: U3.21 10.45,20.69 10.01,20.24 10.01,12.12 9.32,11.43 MINIPROG.4
SWDIO
  Top 0.152: U3.20 10.01,21.19 9.27,20.45 9.27,14.96 8.28,13.97 MINIPROG.5
USB
  Top 0.152: 8.29,38.02 C24.2
  Top 0.305: U$1.P1 5.85,36.48 7.39,38.02 8.29,38.02 | C24.2 9.08,38.01 10.39,39.32 19.07,39.34 23.27,35.18 32.28,35.18 40.21,43 40.21,43.46 40.54,43.79 41.29,43.79 C7.1 41.75,44.26 U2.P$2
USB_SEL
  Top 0.152: U2.P$4 42.85,43.26 42.65,43.05 42.65,41.66 42.39,41.4 41.73,41.4 41.55,41.22 R21.2 38.95,40.7 32.56,34.31 25.83,34.31 25.43,34.04 U3.76
XBEE_DTR
  Top 0.152: U3.44 22.41,15.67 22.89,15.21 29.01,15.21 29.67,14.55 29.67,5.66 30.11,5.22 U4.9
XBEE_RX
  Top 0.152: U3.45 22.91,15.88 23.22,15.57 30.12,15.57 31.06,16.51 31.06,16.89 31.4,17.22 U4.3
XBEE_TX
  Top 0.152: U3.46 23.41,16.04 23.47,15.98 29.62,15.98 30.33,16.69 30.33,17.9 31.65,19.22 U4.2
XRES
  Top 0.152: U3.15 10.51,23.69 10.01,23.19 10.01,22.28 8.59,20.85 8.59,16.41 7.67,15.49 3.96,15.49 3.23,14.86 3.23,9.45 3.86,8.84 MINIPROG.3

### Text on the board
bNames: EEC 136 / Team Bravo / Beta 1.0